# Altium schematic sheet Scheme.SchDoc
size A4
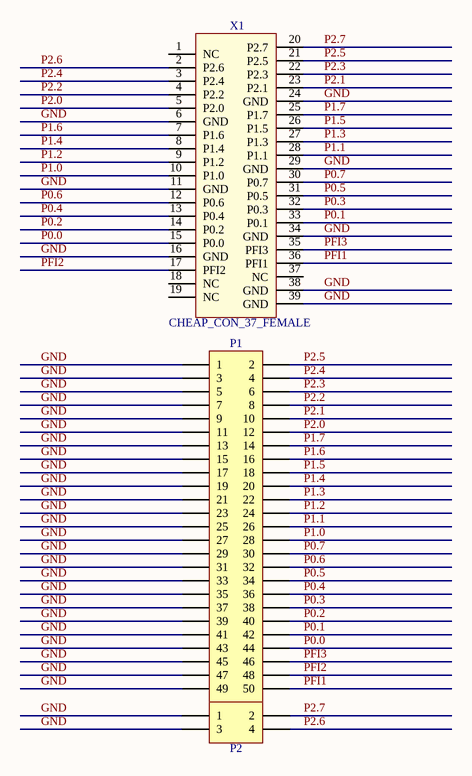
[diagram p0: Scheme.SchDoc]

## Parts
P1  Header 25X2  [HDR2X25]  (value not drawn)
P2  Header 2X2  [HDR2X2]  (value not drawn)
X1  CHEAP_CON_37_FEMALE  [CHEAP_CONN_FEMALE]

## Nets
GND: P1.1 P1.3 P1.5 P1.7 P1.9 P1.11 P1.13 P1.15 P1.17 P1.19 P1.21 P1.23 P1.25 P1.27 P1.29 P1.31 P1.33 P1.35 P1.37 P1.39 P1.41 P1.43 P1.45 P1.47 P1.49 P2.1 P2.3 X1.6(GND) X1.11(GND) X1.16(GND) X1.24(GND) X1.29(GND) X1.34(GND) X1.38(GND) X1.39(GND)
P0.0: P1.44 X1.15(P0.0)
P0.1: P1.42 X1.33(P0.1)
P0.2: P1.40 X1.14(P0.2)
P0.3: P1.38 X1.32(P0.3)
P0.4: P1.36 X1.13(P0.4)
P0.5: P1.34 X1.31(P0.5)
P0.6: P1.32 X1.12(P0.6)
P0.7: P1.30 X1.30(P0.7)
P1.0: P1.28 X1.10(P1.0)
P1.1: P1.26 X1.28(P1.1)
P1.2: P1.24 X1.9(P1.2)
P1.3: P1.22 X1.27(P1.3)
P1.4: P1.20 X1.8(P1.4)
P1.5: P1.18 X1.26(P1.5)
P1.6: P1.16 X1.7(P1.6)
P1.7: P1.14 X1.25(P1.7)
P2.0: P1.12 X1.5(P2.0)
P2.1: P1.10 X1.23(P2.1)
P2.2: P1.8 X1.4(P2.2)
P2.3: P1.6 X1.22(P2.3)
P2.4: P1.4 X1.3(P2.4)
P2.5: P1.2 X1.21(P2.5)
P2.6: P2.4 X1.2(P2.6)
P2.7: P2.2 X1.20(P2.7)
PFI1: P1.50 X1.36(PFI1)
PFI2: P1.48 X1.17(PFI2)
PFI3: P1.46 X1.35(PFI3)

Not connected (* = marked no-connect by the designer): X1 1(NC) 18(NC) 19(NC) 37(NC)

## Library data of the parts
P1 = Header 25X2: Header, 25-Pin, Dual row; LatestRevisionDate: 17-Jul-2002; LatestRevisionNote: Re-released for DXP Platform.; Publisher: Altium Limited
P2 = Header 2X2: Header, 2-Pin, Dual row; LatestRevisionDate: 17-Jul-2002; LatestRevisionNote: Re-released for DXP Platform.; Publisher: Altium Limited